# Altium schematic sheet SERVOS.SchDoc
size 271 x 281 mm; SheetNumber: 7; SheetTotal: 7
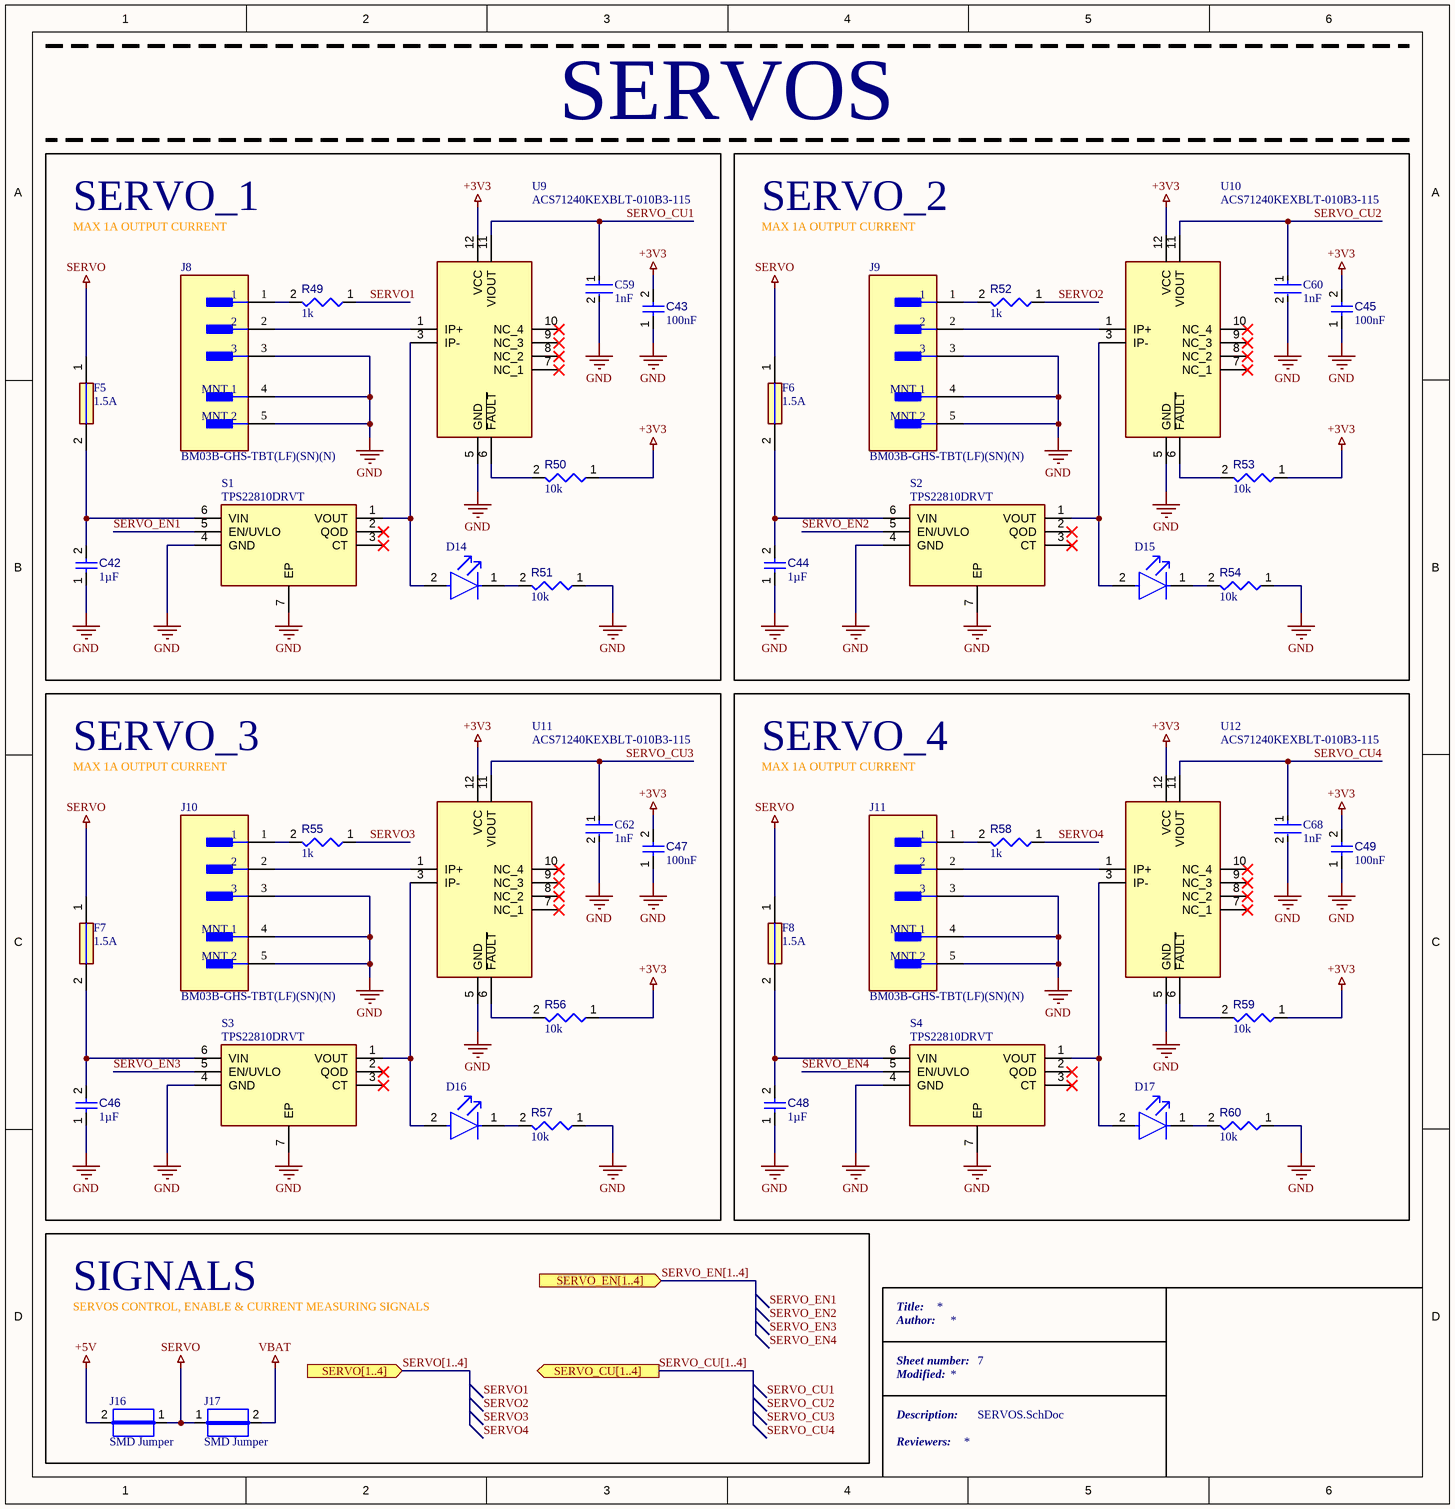
[diagram p0: SERVOS.SchDoc]

## Parts
C42  value 1µF  [CAPC0402(1005)60_L]  (hidden comment: Capacitor 1µF +/-20% 10V 0402)
C43  value 100nF  [CAPC0402(1005)60_L]  (hidden comment: Capacitor 100nF +/-20% 10V 0402)
C44  value 1µF  [CAPC0402(1005)60_L]  (hidden comment: Capacitor 1µF +/-20% 10V 0402)
C45  value 100nF  [CAPC0402(1005)60_L]  (hidden comment: Capacitor 100nF +/-20% 10V 0402)
C46  value 1µF  [CAPC0402(1005)60_L]  (hidden comment: Capacitor 1µF +/-20% 10V 0402)
C47  value 100nF  [CAPC0402(1005)60_L]  (hidden comment: Capacitor 100nF +/-20% 10V 0402)
C48  value 1µF  [CAPC0402(1005)60_L]  (hidden comment: Capacitor 1µF +/-20% 10V 0402)
C49  value 100nF  [CAPC0402(1005)60_L]  (hidden comment: Capacitor 100nF +/-20% 10V 0402)
C59  1nF  [FP-GRM155-0_05-IPC_B]
C60  1nF  [FP-GRM155-0_05-IPC_B]
C62  1nF  [FP-GRM155-0_05-IPC_B]
C68  1nF  [FP-GRM155-0_05-IPC_B]
D14  (no value)  [FP-LTST-C191TBKT-MFG]
D15  (no value)  [FP-LTST-C191TBKT-MFG]
D16  (no value)  [FP-LTST-C191TBKT-MFG]
D17  (no value)  [FP-LTST-C191TBKT-MFG]
F5  1.5A  [FUSC2516X100N]
F6  1.5A  [FUSC2516X100N]
F7  1.5A  [FUSC2516X100N]
F8  1.5A  [FUSC2516X100N]
J8  BM03B-GHS-TBT(LF)(SN)(N)  [FP-BM03B-GHS-TBT_LF_SN-MFG]
J9  BM03B-GHS-TBT(LF)(SN)(N)  [FP-BM03B-GHS-TBT_LF_SN-MFG]
J10  BM03B-GHS-TBT(LF)(SN)(N)  [FP-BM03B-GHS-TBT_LF_SN-MFG]
J11  BM03B-GHS-TBT(LF)(SN)(N)  [FP-BM03B-GHS-TBT_LF_SN-MFG]
J16  SMD Jumper  [RESC3225X06N]
J17  SMD Jumper  [RESC3225X06N]
R49  value 1k  [RESC0402(1005)_L]  (hidden comment: Resistor 1K +/-5 % 0402 63 mW)
R50  value 10k  [RESC0402(1005)_L]  (hidden comment: Resistor 10K  +/-1 % 0402 63 mW)
R51  value 10k  [RESC0402(1005)_L]  (hidden comment: Resistor 10K  +/-1 % 0402 63 mW)
R52  value 1k  [RESC0402(1005)_L]  (hidden comment: Resistor 1K +/-5 % 0402 63 mW)
R53  value 10k  [RESC0402(1005)_L]  (hidden comment: Resistor 10K  +/-1 % 0402 63 mW)
R54  value 10k  [RESC0402(1005)_L]  (hidden comment: Resistor 10K  +/-1 % 0402 63 mW)
R55  value 1k  [RESC0402(1005)_L]  (hidden comment: Resistor 1K +/-5 % 0402 63 mW)
R56  value 10k  [RESC0402(1005)_L]  (hidden comment: Resistor 10K  +/-1 % 0402 63 mW)
R57  value 10k  [RESC0402(1005)_L]  (hidden comment: Resistor 10K  +/-1 % 0402 63 mW)
R58  value 1k  [RESC0402(1005)_L]  (hidden comment: Resistor 1K +/-5 % 0402 63 mW)
R59  value 10k  [RESC0402(1005)_L]  (hidden comment: Resistor 10K  +/-1 % 0402 63 mW)
R60  value 10k  [RESC0402(1005)_L]  (hidden comment: Resistor 10K  +/-1 % 0402 63 mW)
S1  TPS22810DRVT  [SON65P200X200X80-7N]
S2  TPS22810DRVT  [SON65P200X200X80-7N]
S3  TPS22810DRVT  [SON65P200X200X80-7N]
S4  TPS22810DRVT  [SON65P200X200X80-7N]
U9  ACS71240KEXBLT-010B3-115  [ACS71240KEXBLT010B3115]
U10  ACS71240KEXBLT-010B3-115  [ACS71240KEXBLT010B3115]
U11  ACS71240KEXBLT-010B3-115  [ACS71240KEXBLT010B3115]
U12  ACS71240KEXBLT-010B3-115  [ACS71240KEXBLT010B3115]

## Blocks framed on the sheet
SERVOS: C42 C43 C59 D14 F5 J8 R49-R51 S1 U9
SERVO_2: C44 C45 C60 D15 F6 J9 R52-R54 S2 U10
SERVO_3: C46 C47 C62 D16 F7 J10 R55-R57 S3 U11
SERVO_4: C48 C49 C68 D17 F8 J11 R58-R60 S4 U12
SIGNALS: J16 J17

## Ports
SERVO[1..4] (in, see MAIN_BOARD[3C], MCU[6A]), SERVO_CU[1..4] (out, see MAIN_BOARD[3C], MCU[6A]), SERVO_EN[1..4] (in, see MAIN_BOARD[3C], MCU[6B])

## Nets
+3V3: C43.2 C45.2 C47.2 C49.2 R50.1 R53.1 R56.1 R59.1 U9.12(VCC) U10.12(VCC) U11.12(VCC) U12.12(VCC)
+5V: J16.2
GND: C42.1 C43.1 C44.1 C45.1 C46.1 C47.1 C48.1 C49.1 C59.2 C60.2 C62.2 C68.2 J8.3 J8.4(MNT_1) J8.5(MNT_2) J9.3 J9.4(MNT_1) J9.5(MNT_2) J10.3 J10.4(MNT_1) J10.5(MNT_2) J11.3 J11.4(MNT_1) J11.5(MNT_2) R51.1 R54.1 R57.1 R60.1 S1.4(GND) S1.7(EP) S2.4(GND) S2.7(EP) S3.4(GND) S3.7(EP) S4.4(GND) S4.7(EP) U9.5(GND) U10.5(GND) U11.5(GND) U12.5(GND)
SERVO: F5.1 F6.1 F7.1 F8.1 J16.1 J17.1
VBAT: J17.2
SERVO1: R49.1
SERVO2: R52.1
SERVO3: R55.1
SERVO4: R58.1
SERVO_CU1: C59.1 U9.11(VIOUT)
SERVO_CU2: C60.1 U10.11(VIOUT)
SERVO_CU3: C62.1 U11.11(VIOUT)
SERVO_CU4: C68.1 U12.11(VIOUT)
SERVO_EN1: S1.5(EN/UVLO)
SERVO_EN2: S2.5(EN/UVLO)
SERVO_EN3: S3.5(EN/UVLO)
SERVO_EN4: S4.5(EN/UVLO)
NetC42_2: C42.2 F5.2 S1.6(VIN)
NetC44_2: C44.2 F6.2 S2.6(VIN)
NetC46_2: C46.2 F7.2 S3.6(VIN)
NetC48_2: C48.2 F8.2 S4.6(VIN)
NetD14_1: D14.1(C) R51.2
NetD14_2: D14.2(A) S1.1(VOUT) U9.3(IP-)
NetD15_1: D15.1(C) R54.2
NetD15_2: D15.2(A) S2.1(VOUT) U10.3(IP-)
NetD16_1: D16.1(C) R57.2
NetD16_2: D16.2(A) S3.1(VOUT) U11.3(IP-)
NetD17_1: D17.1(C) R60.2
NetD17_2: D17.2(A) S4.1(VOUT) U12.3(IP-)
NetJ8_1: J8.1 R49.2
NetJ8_2: J8.2 U9.1(IP+)
NetJ9_1: J9.1 R52.2
NetJ9_2: J9.2 U10.1(IP+)
NetJ10_1: J10.1 R55.2
NetJ10_2: J10.2 U11.1(IP+)
NetJ11_1: J11.1 R58.2
NetJ11_2: J11.2 U12.1(IP+)
NetR50_2: R50.2 U9.6(~{FAULT})
NetR53_2: R53.2 U10.6(~{FAULT})
NetR56_2: R56.2 U11.6(~{FAULT})
NetR59_2: R59.2 U12.6(~{FAULT})

Not connected (* = marked no-connect by the designer): S1 2(QOD)* 3(CT)*; S2 2(QOD)* 3(CT)*; S3 2(QOD)* 3(CT)*; S4 2(QOD)* 3(CT)*; U9 7(NC_1)* 8(NC_2)* 9(NC_3)* 10(NC_4)*; U10 7(NC_1)* 8(NC_2)* 9(NC_3)* 10(NC_4)*; U11 7(NC_1)* 8(NC_2)* 9(NC_3)* 10(NC_4)*; U12 7(NC_1)* 8(NC_2)* 9(NC_3)* 10(NC_4)*

## Buses and harness runs
bus SERVO[1..4] = port SERVO[1..4]
bus SERVO_CU[1..4] = port SERVO_CU[1..4]
bus SERVO_EN[1..4] = port SERVO_EN[1..4]

## Notes on the sheet
- SERVO_1
- MAX 1A OUTPUT CURRENT
- SERVOS CONTROL, ENABLE & CURRENT MEASURING SIGNALS
- Title:
- Author:
- Sheet number:
- Modified:
- Description:
- Reviewers:
- Labels drawn without touching a wire or pin: SERVO1, SERVO2, SERVO3, SERVO4, SERVO_CU1, SERVO_CU2, SERVO_CU3, SERVO_CU4, SERVO_EN1, SERVO_EN2, SERVO_EN3, SERVO_EN4
- THIS DOCUMENT AND THE DATA DISCLOSED HEREIN OR
- HEREWITH IS THE PROPERTY OF ALTIUM LIMITED AND MAY
- DWG NO:
- REVISION
- REV:
- DESCRIPTION
- DATE
- APPROVED
- BE FREELY DISTRIBUTED IN WHOLE. NO RIGHTS ARE
- RESERVED OR EXPRESS OR IMPLIED WARANTEE GIVEN.
- ENG:
- APPROVALS
- PROJECT
- DSN:
- CHK:
- REFERENCE DOCUMENTS
- PROJECT REVISION:
- TITLE
- DOCUMENT REVISION:
- DESIGN ITEM:
- BOM:
- FAB DWG:
- PCB DWG:
- ASSY DWG:
- SCALE:
- A3
- SIZE
- CAGE CODE
- FILE NAME
- DWG NO.
- SHEET
- OF
- REV

## Library data of the parts
C42 C44 C46 C48 = CMP-001-00063-3: Chip Capacitor, 1µF +/-20%, 10V, 0402, Thickness 0.6 mm; Tolerance: 10%; Mounting Technology: SMT; Max Operating Temperature: 85°C; Voltage Rating: 10V; Pins: 2; Case/Package: 0402; Min Operating Temperature: -55°C
C43 C45 C47 C49 = CMP-001-00061-3: Chip Capacitor, 100nF +/-20%, 10V, 0402, Thickness 0.6 mm; Tolerance: 20%; Mounting Technology: SMT; Voltage Rating: 10V; Max Operating Temperature: 85°C; Pins: 2; Case/Package: 0402; Min Operating Temperature: -55°C
C59 C60 C62 C68 = CMP-2008-04254-2: Chip Multilayer Ceramic Capacitors for General Purpose, 0402, 1000pF, C0G, 30ppm/°C, 5%, 50V; Insulation Resistance: 10GR; Packaging: Tape and Reel; Lead Free: Lead Free; Tolerance: 5%; Temperature Coefficient: 30ppm/°C; Thickness: 0.022inch; Termination: SMD/SMT; Max Operating Temperature: 125°C; Height: 0.5mm; Package Quantity: 1; Radiation Hardening: No; Material: Ceramic; Case Code (Metric): 1005; Number of Pins: 2; Voltage Rating: 50V; Mount: Surface Mount; Voltage: 50V; Case/Package: 0402; Min Operating Temperature: -55°C; Dielectric Material: Ceramic; Width: 0.5mm; Depth: 0.5mm; Case Code (Imperial): 0402; REACH SVHC: No SVHC; Dielectric: C0G; Capacitance: 1nF; Voltage Rating (DC): 50V; Length: 1mm
D14-D17 = CMP-22017-000008-1: LED BLUE CLEAR CHIP SMD; Lens Color: Colorless; Dominant Wavelength: 475nm; Forward Current: 20mA; Wavelength: 468nm; Viewing Angle: 130°; Power Dissipation: 76mW; Luminous Intensity: 180mcd; Reverse Voltage: 5V; Number of Elements: 1; Lens Style: Diffused; Forward Voltage: 3.8V; Max Power Dissipation: 75mW; Case Code (Metric): 1608; Packaging: Tape and Reel; Case/Package: 0603; Depth: 1.6mm; Mount: Surface Mount; Lead Free: Lead Free; Min Operating Temperature: -20°C; Lens Transparency: Clear; Illumination Color: Blue; Height: 0.55mm; Test Current: 20mA; Case Code (Imperial): 0603; Max Operating Temperature: 80°C; Number of Pins: 2; Length: 0.8mm; Radiation Hardening: No; Package Quantity: 1; Number of LEDs: 1; Width: 0.8mm; Color: Blue
F5-F8 = PTSLR08058V300: Fuse; Manufacturer_Name: Eaton; Datasheet Link: https://gr.mouser.com/datasheet/2/87/eaton_ptslr0805_surface_mount_resettable_fuse_data-1839574.pdf; Height: 1mm; Manufacturer_Part_Number: PTSLR08058V300
J8-J11 = CMP-17439-000058-1: CONN HEADER SMD 3POS 1.25MM; Pitch: 0.049inch; Number of Positions: 3; Contact Finish - Mating: TIN; Lead Free: Lead Free; Series: GH; Fastening Type: Ramp; Number of Rows: 1; Insulation Color: Natural; Contact Material: Bronze; Insulation Material: Nylon; Min Operating Temperature: -25°C; Contact Type: Outer Shroud Contact; Max Operating Temperature: 85°C; Termination: Solder; Flammability Rating: UL94 V-0; Color: Natural; Contact Plating: Tin; Contact Shape: Rectangular; Mount: Surface Mount; Packaging: Cut Tape; Connector Type: Header
J16 J17 = CMP-00030-00001-2: SMD Jumper, size 1210 (imperial); Mounting Technology: SMD; RoHS Compliant: Yes; Case/Package: 1210 (imperial); Pins: 2; Max Operating Temperature: 1000°C; Min Operating Temperature: -1000°C
R49 R52 R55 R58 = CMP-009-00157-3: Chip Resistor, 1 kOhms, +/-5 %, 63 mW, -55 to 155 degC, 0402; Tolerance: 5%; Power: 63mW; Case/Package: 0402; Pins: 2; Min Operating Temperature: -55°C; Max Operating Temperature: 155°C
R50 R51 R53 R54 R56 R57 R59 R60 = CMP-009-00149-3: Chip Resistor, 10 kOhms, +/-1 %, 63 mW, -55 to 125 degC, 0402; Power: 63mW; Tolerance: 1%; Min Operating Temperature: -55°C; Case/Package: 0402; Max Operating Temperature: 155°C; Pins: 2
S1-S4 = TPS22810DRVT: Switch; Manufacturer_Name: Texas Instruments; Datasheet Link: http://www.ti.com/general/docs/lit/getliterature.tsp?genericPartNumber=TPS22810&fileType=pdf; Height: 0.8mm; Manufacturer_Part_Number: TPS22810DRVT; Mouser Part Number: 595-TPS22810DRVT; Mouser Price/Stock: https://www.mouser.co.uk/ProductDetail/Texas-Instruments/TPS22810DRVT?qs=5aG0NVq1C4wtEcND0E9Qlg%3D%3D; Arrow Part Number: TPS22810DRVT; Arrow Price/Stock: https://www.arrow.com/en/products/tps22810drvt/texas-instruments?region=nac
U9-U12 = ACS71240KEXBLT-010B3-115: Integrated Circuit; Manufacturer_Name: Allegro Microsystems; Datasheet Link: https://www.allegromicro.com/-/media/files/datasheets/acs71240-datasheet.ashx; Height: 0.8mm; Manufacturer_Part_Number: ACS71240KEXBLT-010B3-115; Mouser Part Number: 250-71240KEXBL0B3115; Mouser Price/Stock: https://www.mouser.co.uk/ProductDetail/Allegro-MicroSystems/ACS71240KEXBLT-010B3-115?qs=pUKx8fyJudB4EfgYZFsj7A%3D%3D; Arrow Part Number: ACS71240KEXBLT-010B3-115; Arrow Price/Stock: https://www.arrow.com/en/products/acs71240kexblt-010b3-115/allegro-microsystems?region=nac